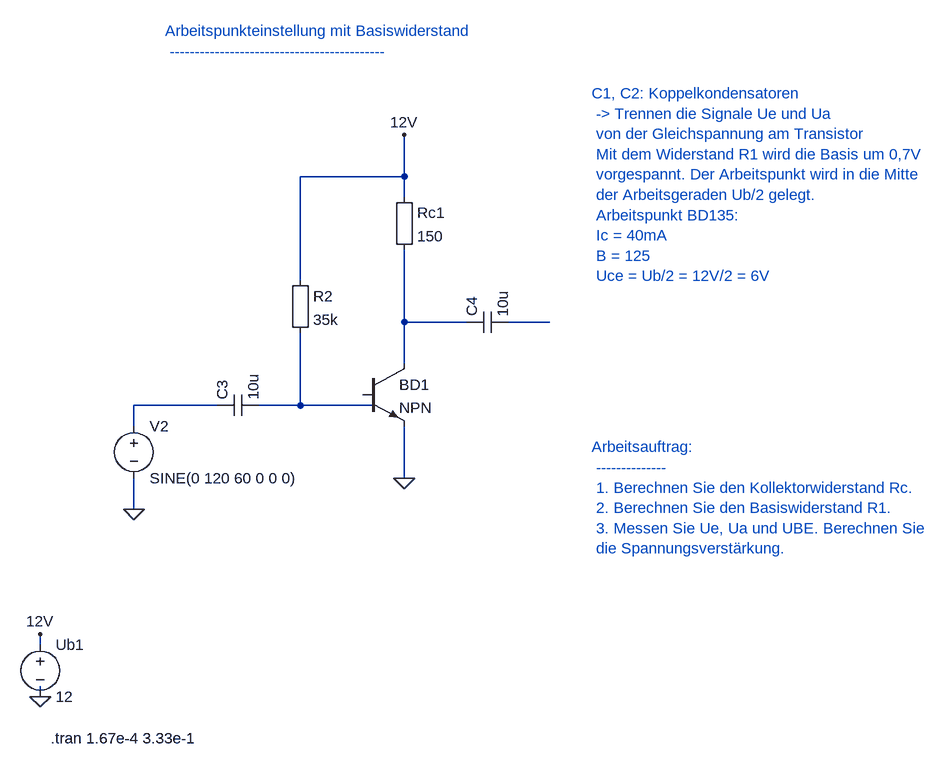
[diagram p0: schematic 9_1_2_Arbeitspunkteinstellung_Emitterschaltung.asc]
9_1_2_Arbeitspunkteinstellung_Emitterschaltung.asc, the LTspice schematic file:
Version 4
SHEET 1 880 680
WIRE 48 1072 48 1056
WIRE 544 608 560 608
WIRE 560 608 560 624
WIRE 608 656 608 688
WIRE 192 736 192 752
WIRE 384 624 400 624
WIRE 768 496 784 496
WIRE 48 992 48 976
WIRE 608 688 608 736
WIRE 192 784 192 752
WIRE 608 304 608 272
WIRE 608 384 608 496
WIRE 608 496 608 560
WIRE 832 496 784 496
WIRE 608 272 608 208
WIRE 448 432 448 272
WIRE 448 272 608 272
WIRE 400 624 448 624
WIRE 448 624 560 624
WIRE 448 512 448 624
WIRE 320 624 192 624
WIRE 192 624 192 656
WIRE 704 496 608 496
FLAG 608 736 0
FLAG 48 1072 0
FLAG 192 784 0
FLAG 608 736 0
FLAG 48 1072 0
FLAG 192 784 0
FLAG 608 208 12V
FLAG 48 976 12V
SYMBOL voltage 48 976 R0
SYMATTR InstName Ub1
SYMATTR Value 12
SYMBOL npn 544 560 R0
SYMATTR InstName BD1
SYMATTR Value NPN
SYMBOL Misc\EuropeanResistor 432 416 R0
SYMATTR InstName R2
SYMATTR Value 35k
SYMBOL voltage 192 640 R0
SYMATTR InstName V2
SYMATTR Value SINE(0 120 60 0 0 0)
SYMBOL Misc\EuropeanResistor 592 288 R0
SYMATTR InstName Rc1
SYMATTR Value 150
SYMBOL cap 320 640 R270
SYMATTR InstName C3
SYMATTR Value 10u
SYMBOL cap 704 512 R270
SYMATTR InstName C4
SYMATTR Value 10u
TEXT 64 1136 Left 2 !.tran 1.67e-4 3.33e-1
TEXT 240 48 Left 2 ;Arbeitspunkteinstellung mit Basiswiderstand \n -------------------------------------------
TEXT 896 688 Left 2 ;Arbeitsauftrag: \n -------------- \n 1. Berechnen Sie den Kollektorwiderstand Rc. \n 2. Berechnen Sie den Basiswiderstand R1. \n 3. Messen Sie Ue, Ua und UBE. Berechnen Sie \n die Spannungsverstärkung.
TEXT 896 144 Left 2 ;C1, C2: Koppelkondensatoren \n -> Trennen die Signale Ue und Ua \n von der Gleichspannung am Transistor \n Mit dem Widerstand R1 wird die Basis um 0,7V \n vorgespannt. Der Arbeitspunkt wird in die Mitte \n der Arbeitsgeraden Ub/2 gelegt. \n Arbeitspunkt BD135: \n Ic = 40mA \n B = 125 \n Uce = Ub/2 = 12V/2 = 6V

The netlist it stands for:
* 9_1_2_Arbeitspunkteinstellung_Emitterschaltung.asc
V§Ub1 12V 0 12
Q§BD1 N003 N001 0 0 NPN
R2 12V N001 35k
V2 N004 0 SINE(0 120 60 0 0 0)
Rc1 12V N003 150
C3 N004 N001 10u
C4 N003 N002 10u
.model NPN NPN
.model PNP PNP
.lib standard.bjt
.tran 1.67e-4 3.33e-1
* Arbeitspunkteinstellung mit Basiswiderstand
*  -------------------------------------------
* Arbeitsauftrag:
*  --------------
*  1. Berechnen Sie den Kollektorwiderstand Rc.
*  2. Berechnen Sie den Basiswiderstand R1.
*  3. Messen Sie Ue, Ua und UBE. Berechnen Sie
*  die Spannungsverstärkung.
* C1, C2: Koppelkondensatoren
*  -> Trennen die Signale Ue und Ua
*  von der Gleichspannung am Transistor
*  Mit dem Widerstand R1 wird die Basis um 0,7V
*  vorgespannt. Der Arbeitspunkt wird in die Mitte
*  der Arbeitsgeraden Ub/2 gelegt.
*  Arbeitspunkt BD135:
*  Ic = 40mA
*  B = 125
*  Uce = Ub/2 = 12V/2 = 6V
.backanno
.end